# EAGLE design vewa-lfos (EAGLE 6.6.0)
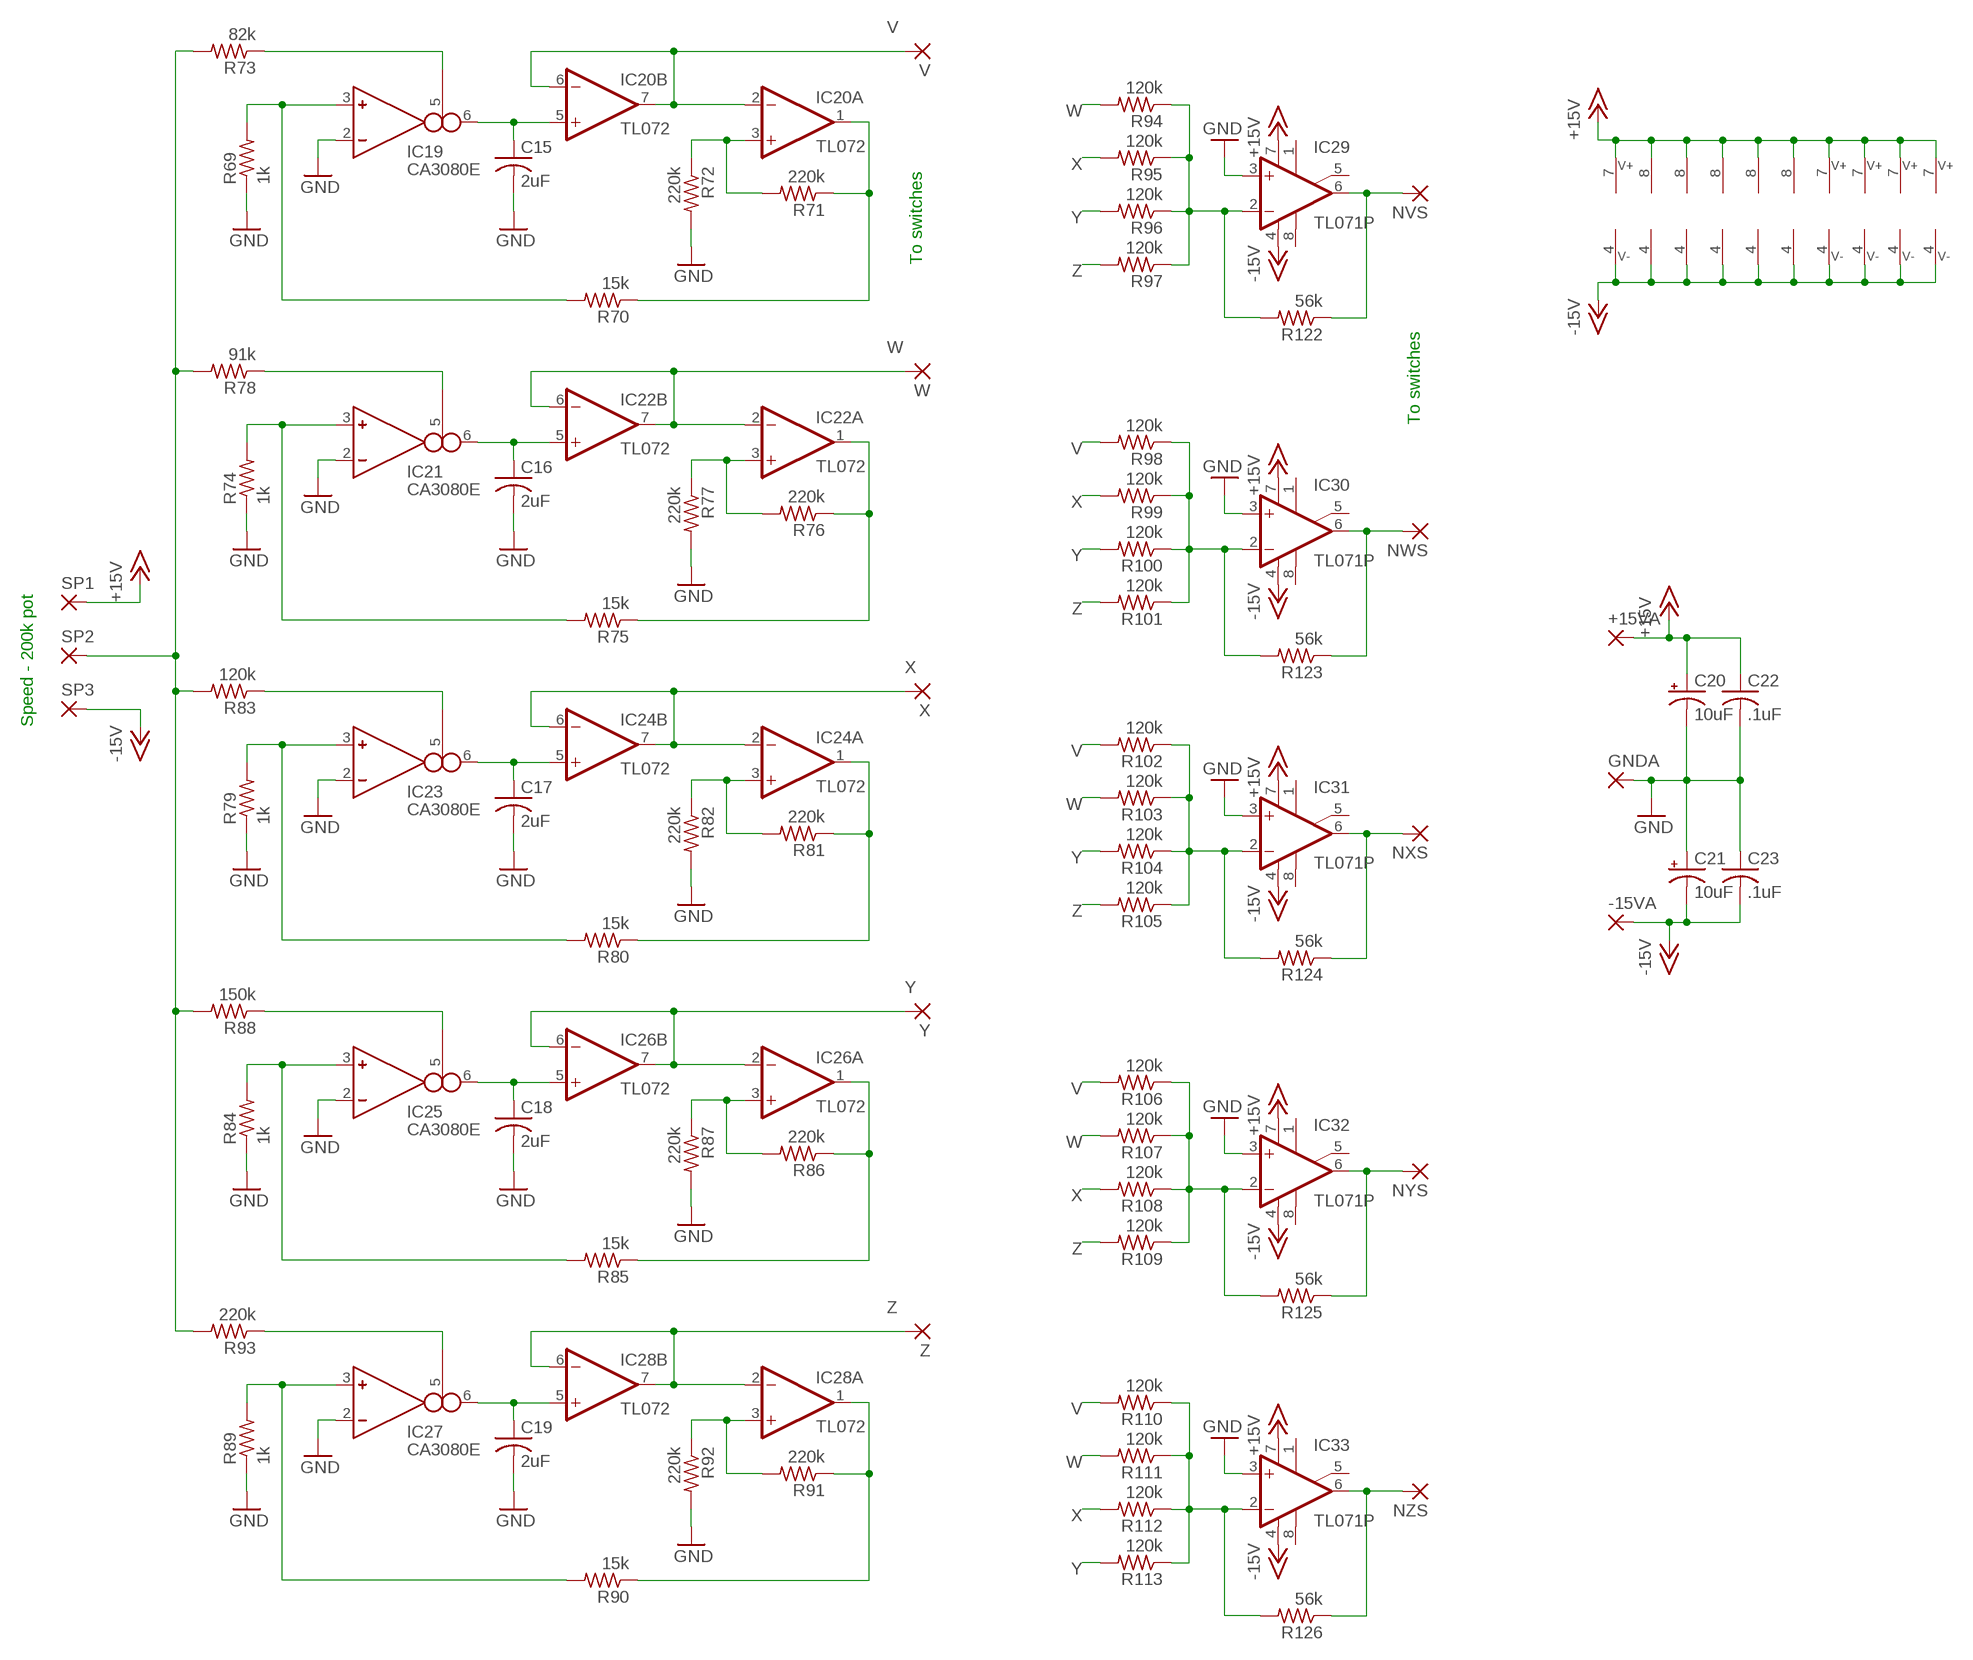
[diagram p0: schematic, sheet 1]

## Parts
+15VA  2,54/1,0  [2,54/1,0]
-15VA  2,54/1,0  [2,54/1,0]
C15  2uF  C-US050-025X075  [C050-025X075]
C16  2uF  C-US050-025X075  [C050-025X075]
C17  2uF  C-US050-025X075  [C050-025X075]
C18  2uF  C-US050-025X075  [C050-025X075]
C19  2uF  C-US050-025X075  [C050-025X075]
C20  10uF  CPOL-USE2.5-5  [E2,5-5]
C21  10uF  CPOL-USE2.5-5  [E2,5-5]
C22  .1uF  C-US050-025X075  [C050-025X075]
C23  .1uF  C-US050-025X075  [C050-025X075]
GNDA  2,54/1,0  [2,54/1,0]
IC19  CA3080E  [DIL08]
IC20  TL072  TL072-TOPP  [DIL08]
IC21  CA3080E  [DIL08]
IC22  TL072  TL072-TOPP  [DIL08]
IC23  CA3080E  [DIL08]
IC24  TL072  TL072-TOPP  [DIL08]
IC25  CA3080E  [DIL08]
IC26  TL072  TL072-TOPP  [DIL08]
IC27  CA3080E  [DIL08]
IC28  TL072  TL072-TOPP  [DIL08]
IC29  TL071P  [DIL08]
IC30  TL071P  [DIL08]
IC31  TL071P  [DIL08]
IC32  TL071P  [DIL08]
IC33  TL071P  [DIL08]
NVS  2,54/1,0  [2,54/1,0]
NWS  2,54/1,0  [2,54/1,0]
NXS  2,54/1,0  [2,54/1,0]
NYS  2,54/1,0  [2,54/1,0]
NZS  2,54/1,0  [2,54/1,0]
R69  1k  R-US_0207/10  [0207/10]
R70  15k  R-US_0207/10  [0207/10]
R71  220k  R-US_0207/10  [0207/10]
R72  220k  R-US_0207/10  [0207/10]
R73  82k  R-US_0207/10  [0207/10]
R74  1k  R-US_0207/10  [0207/10]
R75  15k  R-US_0207/10  [0207/10]
R76  220k  R-US_0207/10  [0207/10]
R77  220k  R-US_0207/10  [0207/10]
R78  91k  R-US_0207/10  [0207/10]
R79  1k  R-US_0207/10  [0207/10]
R80  15k  R-US_0207/10  [0207/10]
R81  220k  R-US_0207/10  [0207/10]
R82  220k  R-US_0207/10  [0207/10]
R83  120k  R-US_0207/10  [0207/10]
R84  1k  R-US_0207/10  [0207/10]
R85  15k  R-US_0207/10  [0207/10]
R86  220k  R-US_0207/10  [0207/10]
R87  220k  R-US_0207/10  [0207/10]
R88  150k  R-US_0207/10  [0207/10]
R89  1k  R-US_0207/10  [0207/10]
R90  15k  R-US_0207/10  [0207/10]
R91  220k  R-US_0207/10  [0207/10]
R92  220k  R-US_0207/10  [0207/10]
R93  220k  R-US_0207/10  [0207/10]
R94  120k  R-US_0207/10  [0207/10]
R95  120k  R-US_0207/10  [0207/10]
R96  120k  R-US_0207/10  [0207/10]
R97  120k  R-US_0207/10  [0207/10]
R98  120k  R-US_0207/10  [0207/10]
R99  120k  R-US_0207/10  [0207/10]
R100  120k  R-US_0207/10  [0207/10]
R101  120k  R-US_0207/10  [0207/10]
R102  120k  R-US_0207/10  [0207/10]
R103  120k  R-US_0207/10  [0207/10]
R104  120k  R-US_0207/10  [0207/10]
R105  120k  R-US_0207/10  [0207/10]
R106  120k  R-US_0207/10  [0207/10]
R107  120k  R-US_0207/10  [0207/10]
R108  120k  R-US_0207/10  [0207/10]
R109  120k  R-US_0207/10  [0207/10]
R110  120k  R-US_0207/10  [0207/10]
R111  120k  R-US_0207/10  [0207/10]
R112  120k  R-US_0207/10  [0207/10]
R113  120k  R-US_0207/10  [0207/10]
R122  56k  R-US_0207/10  [0207/10]
R123  56k  R-US_0207/10  [0207/10]
R124  56k  R-US_0207/10  [0207/10]
R125  56k  R-US_0207/10  [0207/10]
R126  56k  R-US_0207/10  [0207/10]
SP1  2,54/1,0  [2,54/1,0]
SP2  2,54/1,0  [2,54/1,0]
SP3  2,54/1,0  [2,54/1,0]
V  2,54/1,0  [2,54/1,0]
W  2,54/1,0  [2,54/1,0]
X  2,54/1,0  [2,54/1,0]
Y  2,54/1,0  [2,54/1,0]
Z  2,54/1,0  [2,54/1,0]

## Nets
+15V: +15VA.1(P) C20.+ C22.1 IC19.7 IC20.8(P:V+) IC21.7 IC22.8(P:V+) IC23.7 IC24.8(P:V+) IC25.7 IC26.8(P:V+) IC27.7 IC28.8(P:V+) IC29.7(V+) IC30.7(V+) IC31.7(V+) IC32.7(V+) IC33.7(V+) SP1.1(P)
-15V: -15VA.1(P) C21.- C23.2 IC19.4 IC20.4(P:V-) IC21.4 IC22.4(P:V-) IC23.4 IC24.4(P:V-) IC25.4 IC26.4(P:V-) IC27.4 IC28.4(P:V-) IC29.4(V-) IC30.4(V-) IC31.4(V-) IC32.4(V-) IC33.4(V-) SP3.1(P)
GND: C15.2 C16.2 C17.2 C18.2 C19.2 C20.- C21.+ C22.2 C23.1 GNDA.1(P) IC19.2(IN_N) IC21.2(IN_N) IC23.2(IN_N) IC25.2(IN_N) IC27.2(IN_N) IC29.3(+IN) IC30.3(+IN) IC31.3(+IN) IC32.3(+IN) IC33.3(+IN) R69.1 R72.2 R74.1 R77.2 R79.1 R82.2 R84.1 R87.2 R89.1 R92.2
N$53: C15.1 IC19.6(OUT) IC20.5(B:+IN)
N$54: IC20.3(A:+IN) R71.2 R72.1
N$55: IC20.1(A:OUT) R70.1 R71.1
N$56: IC19.3(IN_P) R69.2 R70.2
N$57: IC19.5(I_BIAS) R73.1
N$60: C16.1 IC21.6(OUT) IC22.5(B:+IN)
N$61: IC22.3(A:+IN) R76.2 R77.1
N$62: IC22.1(A:OUT) R75.1 R76.1
N$63: IC21.3(IN_P) R74.2 R75.2
N$64: IC21.5(I_BIAS) R78.1
N$66: IC29.2(-IN) R94.1 R95.1 R96.1 R97.1 R122.2
N$67: C17.1 IC23.6(OUT) IC24.5(B:+IN)
N$68: IC24.3(A:+IN) R81.2 R82.1
N$69: IC24.1(A:OUT) R80.1 R81.1
N$70: IC23.3(IN_P) R79.2 R80.2
N$71: IC23.5(I_BIAS) R83.1
N$72: IC30.2(-IN) R98.1 R99.1 R100.1 R101.1 R123.2
N$73: IC31.2(-IN) R102.1 R103.1 R104.1 R105.1 R124.2
N$74: C18.1 IC25.6(OUT) IC26.5(B:+IN)
N$75: IC26.3(A:+IN) R86.2 R87.1
N$76: IC26.1(A:OUT) R85.1 R86.1
N$77: IC25.3(IN_P) R84.2 R85.2
N$78: IC25.5(I_BIAS) R88.1
N$79: IC32.2(-IN) R106.1 R107.1 R108.1 R109.1 R125.2
N$80: IC33.2(-IN) R110.1 R111.1 R112.1 R113.1 R126.2
N$81: C19.1 IC27.6(OUT) IC28.5(B:+IN)
N$82: IC28.3(A:+IN) R91.2 R92.1
N$83: IC28.1(A:OUT) R90.1 R91.1
N$84: IC27.3(IN_P) R89.2 R90.2
N$85: IC27.5(I_BIAS) R93.1
N$86: R73.2 R78.2 R83.2 R88.2 R93.2 SP2.1(P)
NVS: IC29.6(OUT) NVS.1(P) R122.1
NWS: IC30.6(OUT) NWS.1(P) R123.1
NXS: IC31.6(OUT) NXS.1(P) R124.1
NYS: IC32.6(OUT) NYS.1(P) R125.1
NZS: IC33.6(OUT) NZS.1(P) R126.1
V: IC20.2(A:-IN) IC20.6(B:-IN) IC20.7(B:OUT) R98.2 R102.2 R106.2 R110.2 V.1(P)
W: IC22.2(A:-IN) IC22.6(B:-IN) IC22.7(B:OUT) R94.2 R103.2 R107.2 R111.2 W.1(P)
X: IC24.2(A:-IN) IC24.6(B:-IN) IC24.7(B:OUT) R95.2 R99.2 R108.2 R112.2 X.1(P)
Y: IC26.2(A:-IN) IC26.6(B:-IN) IC26.7(B:OUT) R96.2 R100.2 R104.2 R113.2 Y.1(P)
Z: IC28.2(A:-IN) IC28.6(B:-IN) IC28.7(B:OUT) R97.2 R101.2 R105.2 R109.2 Z.1(P)
Unconnected: IC29.1(ON1) IC29.5(ON2) IC29.8(OPT) IC30.1(ON1) IC30.5(ON2) IC30.8(OPT) IC31.1(ON1) IC31.5(ON2) IC31.8(OPT) IC32.1(ON1) IC32.5(ON2) IC32.8(OPT) IC33.1(ON1) IC33.5(ON2) IC33.8(OPT)

## Notes on the sheet
- To switches
- To switches
- Speed - 200k pot

## Library data of the parts
+15VA -15VA GNDA NVS NWS NXS NYS NZS SP1-SP3 V W X Y Z = wirepad:2,54/1,0: THROUGH-HOLE PAD
C15-C19 C22 C23 = rcl:C-US: CAPACITOR, American symbol
C20 C21 = rcl:CPOL-US: POLARIZED CAPACITOR, American symbol
IC19 IC21 IC23 IC25 IC27 = mmoretti:CA3080: OTA
IC20 IC22 IC24 IC26 IC28 = mmoretti:TL072-TOP: OP AMP
IC29-IC33 = mmoretti:TL071: OP AMP
R69-R113 R122-R126 = rcl:R-US_: RESISTOR, American symbol

## Board
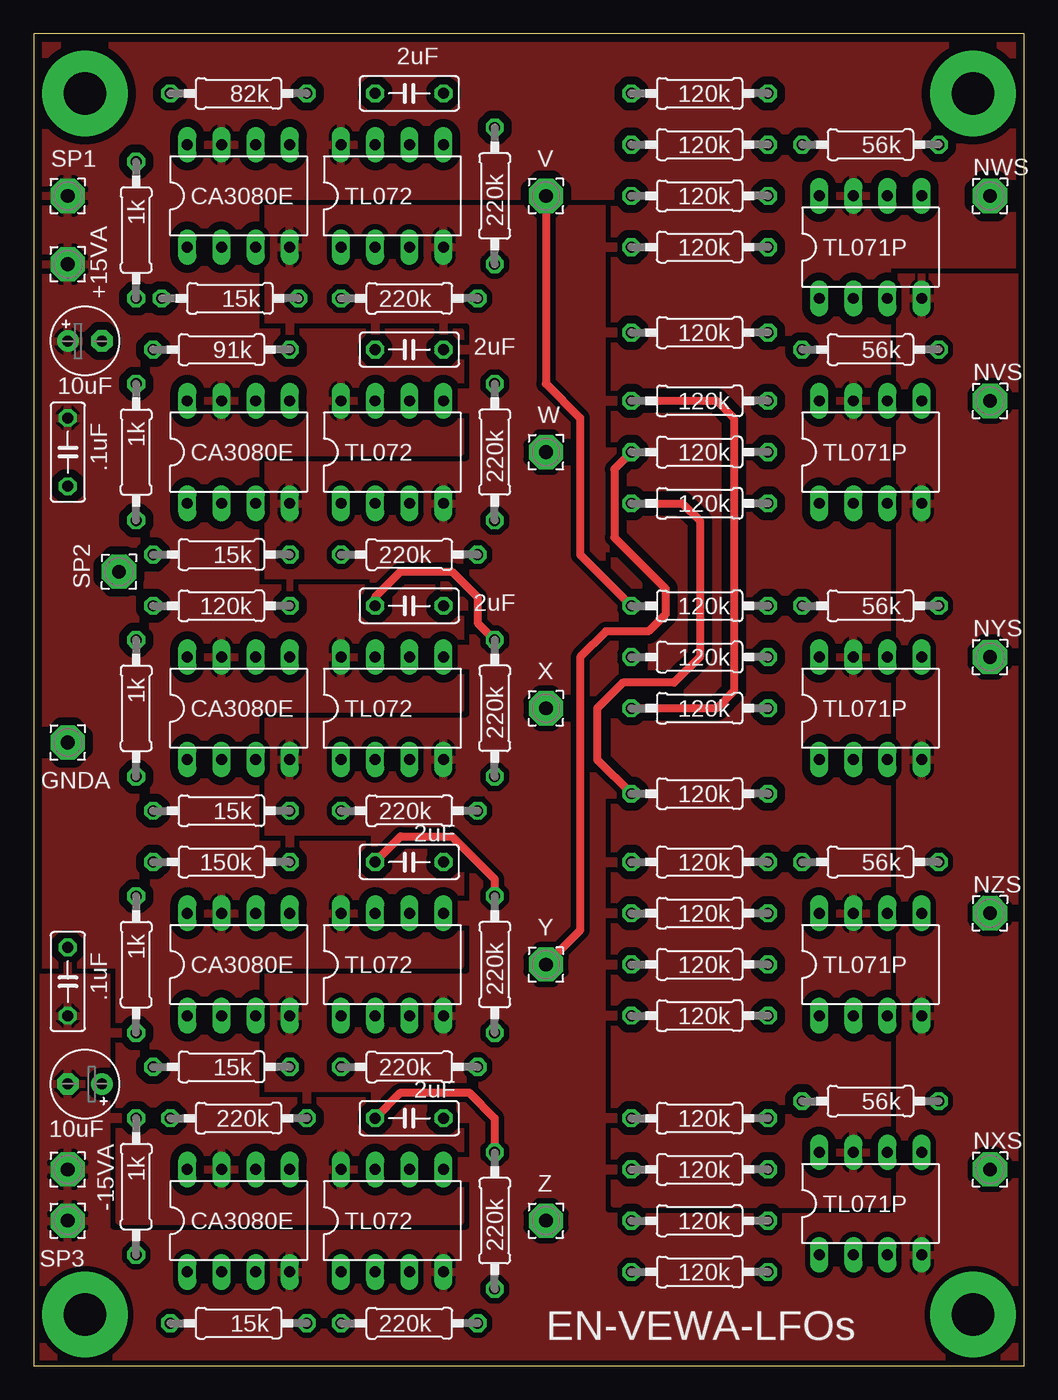
[diagram p1: board, top side]
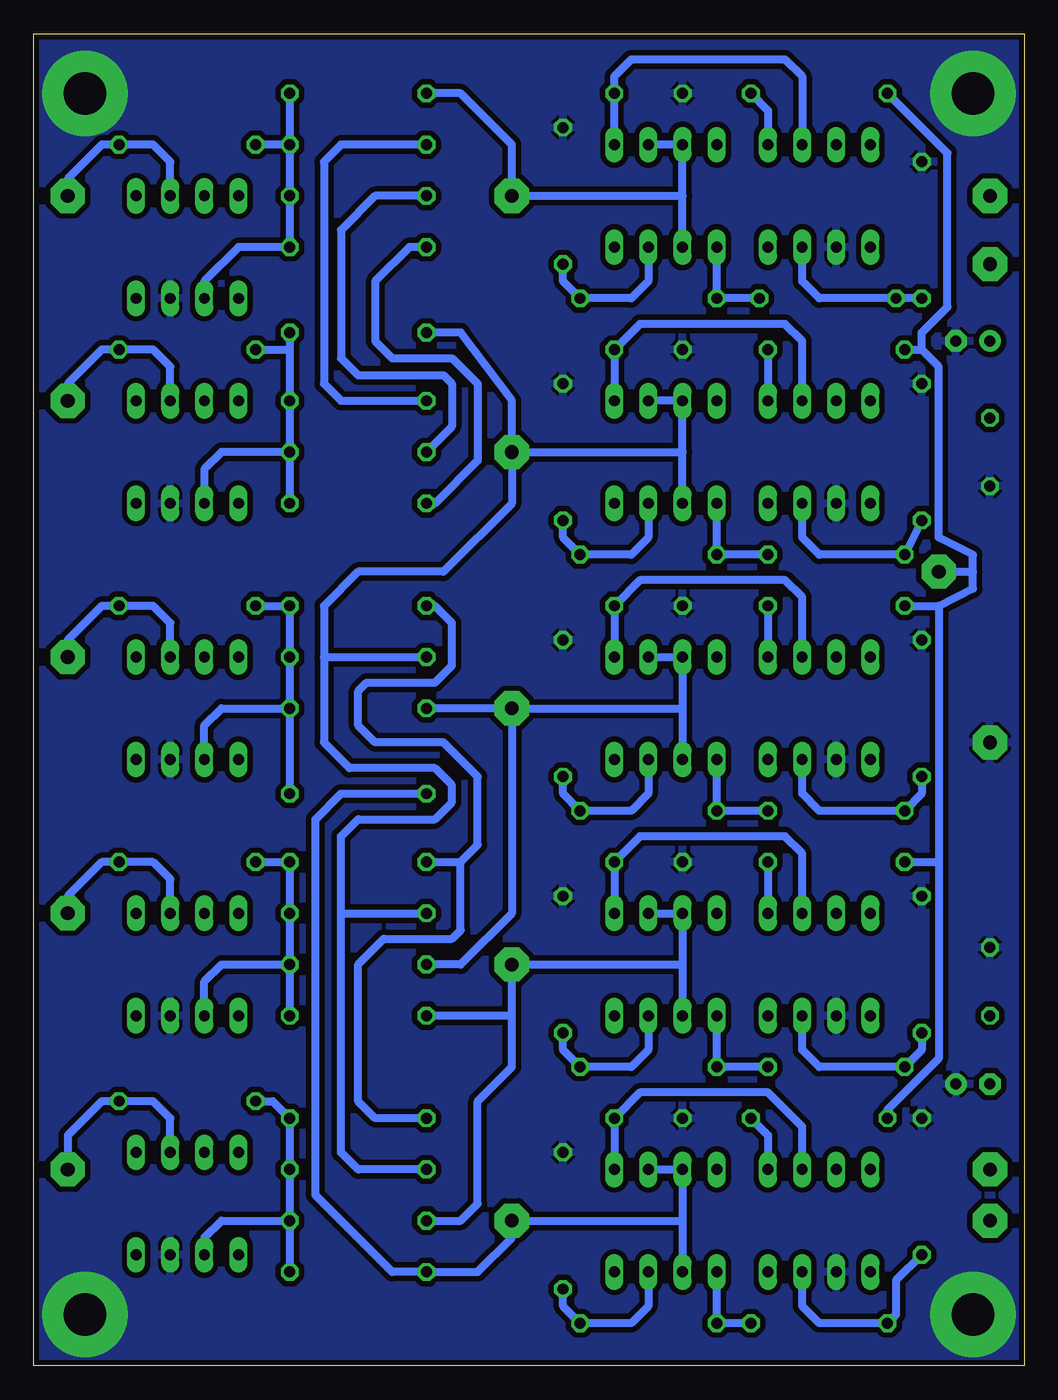
[diagram p2: board, bottom side, seen from below]

Size 73.66 x 99.06 mm. Coordinates in mm from the lower left corner, seen from the top.
Outline: 0,0 73.66,0 73.66,99.06 0,99.06 0,0
Copper layers (1*16): Top 0.035mm / dielectric 1.5mm / Bottom 0.035mm
Design rules "SeeedStudio_2layer_DRU_no_angle_20140221": minimum track width 6mil, minimum drill 12mil, track to track 6mil, track to pad 6mil, pad to pad 6mil, via to via 6mil, smd to smd 0mil, copper to edge 10mil, drill to drill 10mil, minimum pad ring 10mil, minimum via ring 6mil, stop-mask expansion 2mil, vias tented up to drill 100mil, thermal gap 10mil

### Footprints (pad centres in the part's own frame; a part is rotated, then mirrored left to right if it is on the bottom)
2,54/1,0 = drill 1.016 pad 2.54 octagon: 1 0,0
C050-025X075 = drill 0.813 octagon: 1 -2.54,0; 2 2.54,0
E2,5-5 = drill 0.813 pad 1.6: + -1.27,0 | drill 0.813 pad 1.6 octagon: - 1.27,0
DIL08 = drill 0.813 long: 1 -3.81,-3.81; 2 -1.27,-3.81; 3 1.27,-3.81; 4 3.81,-3.81; 5 3.81,3.81; 6 1.27,3.81; 7 -1.27,3.81; 8 -3.81,3.81
0207/10 = drill 0.813 octagon: 1 -5.08,0; 2 5.08,0

### Placement (x,y rotation side)
+15VA  2.54,81.92 0 top
-15VA  2.54,14.61 0 top
C15  27.94,94.61 180 top
C16  27.94,75.56 180 top
C17  27.94,56.52 180 top
C18  27.94,37.47 180 top
C19  27.94,18.41 180 top
C20  3.81,76.2 0 top
C21  3.81,20.95 180 top
C22  2.54,67.94 270 top
C23  2.54,28.57 270 top
GNDA  2.54,46.35 0 top
IC19  15.24,87 0 top
IC20  26.67,87 0 top
IC21  15.24,67.94 0 top
IC22  26.67,67.94 0 top
IC23  15.24,48.9 0 top
IC24  26.67,48.9 0 top
IC25  15.24,29.84 0 top
IC26  26.67,29.84 0 top
IC27  15.24,10.79 0 top
IC28  26.67,10.79 0 top
IC29  62.23,67.94 0 top
IC30  62.23,83.19 0 top
IC31  62.23,12.06 0 top
IC32  62.23,48.9 0 top
IC33  62.23,29.84 0 top
NVS  71.12,71.75 0 top
NWS  71.12,87 0 top
NXS  71.12,14.61 0 top
NYS  71.12,52.7 0 top
NZS  71.12,33.66 0 top
R69  7.62,84.45 270 top
R70  14.61,79.38 180 top
R71  27.94,79.38 0 top
R72  34.29,87 90 top
R73  15.24,94.61 180 top
R74  7.62,67.94 270 top
R75  13.97,60.33 180 top
R76  27.94,60.33 0 top
R77  34.29,67.94 90 top
R78  13.97,75.56 180 top
R79  7.62,48.9 270 top
R80  13.97,41.27 180 top
R81  27.94,41.27 0 top
R82  34.29,48.9 90 top
R83  13.97,56.52 180 top
R84  7.62,29.84 270 top
R85  13.97,22.23 180 top
R86  27.94,22.23 0 top
R87  34.29,29.84 90 top
R88  13.97,37.47 180 top
R89  7.62,13.34 270 top
R90  15.24,3.17 180 top
R91  27.94,3.17 0 top
R92  34.29,10.79 90 top
R93  15.24,18.41 180 top
R94  49.53,76.83 180 top
R95  49.53,71.75 180 top
R96  49.53,67.94 180 top
R97  49.53,64.14 180 top
R98  49.53,94.61 180 top
R99  49.53,90.81 180 top
R100  49.53,87 180 top
R101  49.53,83.19 180 top
R102  49.53,18.41 180 top
R103  49.53,14.61 180 top
R104  49.53,10.79 180 top
R105  49.53,6.99 180 top
R106  49.53,56.52 180 top
R107  49.53,52.7 180 top
R108  49.53,48.9 180 top
R109  49.53,42.55 180 top
R110  49.53,37.47 180 top
R111  49.53,33.66 180 top
R112  49.53,29.84 180 top
R113  49.53,26.04 180 top
R122  62.23,75.56 180 top
R123  62.23,90.81 180 top
R124  62.23,19.68 180 top
R125  62.23,56.52 180 top
R126  62.23,37.47 180 top
SP1  2.54,87 0 top
SP2  6.35,59.05 0 top
SP3  2.54,10.79 0 top
V  38.1,87 0 top
W  38.1,67.94 0 top
X  38.1,48.9 0 top
Y  38.1,29.84 0 top
Z  38.1,10.79 0 top

### Tracks (layer width: path | path; a pad name or v marks a point on that pad's centre or on a via)
+15V
  pour Top (isolate 0.61): 0,29.84 6.35,29.84 6.35,10.79 31.75,10.79 31.75,19.68 16.51,19.68 16.51,29.84 31.75,29.84 31.75,38.73 16.51,38.73 16.51,48.9 31.75,48.9 31.75,57.78 16.51,57.78 16.51,67.94 31.75,67.94 31.75,76.83 16.51,76.83 16.51,87 43.18,87 43.18,12.06 63.5,12.06 63.5,81.92 73.66,81.92 73.66,99.06 0,99.06
-15V
  pour Top (isolate 0.406, rank 2): 0,29.84 6.35,29.84 6.35,10.79 31.75,10.79 31.75,19.68 16.51,19.68 16.51,29.84 31.75,29.84 31.75,38.73 16.51,38.73 16.51,48.9 31.75,48.9 31.75,57.78 16.51,57.78 16.51,67.94 31.75,67.94 31.75,76.83 16.51,76.83 16.51,87 43.18,87 43.18,12.06 63.5,12.06 63.5,81.92 73.66,81.92 73.66,0 0,0
GND  (via drill 3.17 pad 6.35)
  Top 0.61: C18.2 27.3,39.37 31.11,39.37 34.29,36.2 R87.2 | C17.2 25.4,57.15 27.3,59.05 31.11,59.05 33.02,57.15 33.02,55.24 R82.2 | C19.2 27.3,20.32 32.38,20.32 34.29,18.41 R92.2
  other vias: 3.81,94.61 69.85,94.61 69.85,3.81 3.81,3.81
  pour Bottom (isolate 0.406): 0,99.06 73.66,99.06 73.66,0 0,0
N$53
  Bottom 0.61: C15.1 IC20.5 30.48,95.89 29.21,97.16 17.78,97.16 16.51,95.89 IC19.6
N$54
  Bottom 0.61: IC20.3 27.94,80.64 29.21,79.38 R71.2 34.29,80.64 R72.1
N$55
  Bottom 0.61: R70.1 R71.1 IC20.1
N$56
  Bottom 0.61: R69.2 R70.2 15.24,79.38 16.51,80.64 IC19.3
N$57
  Bottom 0.61: R73.1 19.05,93.34 IC19.5
N$60
  Bottom 0.61: IC22.5 C16.1 28.57,77.47 17.78,77.47 16.51,76.2 IC21.6
N$61
  Bottom 0.61: IC22.3 27.94,61.59 29.21,60.33 R76.2 34.29,61.59 R77.1
N$62
  Bottom 0.61: R75.1 R76.1 IC22.1
N$63
  Bottom 0.61: IC21.3 16.51,61.59 15.24,60.33 R75.2 R74.2
N$64
  Bottom 0.61: R78.1 IC21.5
N$66
  Bottom 0.61: R94.1 54.61,75.56 | 54.61,75.56 R95.1 R96.1 | R96.1 R97.1 | R122.2 54.61,75.56 | R96.1 59.69,67.94 60.96,66.67 IC29.2
N$67
  Bottom 0.61: IC23.6 16.51,57.15 17.78,58.42 28.57,58.42 C17.1 IC24.5
N$68
  Bottom 0.61: IC24.3 27.94,42.55 29.21,41.27 R81.2 34.29,42.55 R82.1
N$69
  Bottom 0.61: R80.1 R81.1 IC24.1
N$70
  Bottom 0.61: R79.2 7.62,42.55 R80.2 15.24,41.27 16.51,42.55 IC23.3
N$71
  Bottom 0.61: R83.1 IC23.5
N$72
  Bottom 0.61: R98.1 R99.1 | R99.1 R100.1 R101.1 58.42,83.19 60.96,80.64 IC30.2 | R99.1 R123.2
N$73
  Bottom 0.61: R124.2 55.88,19.68 R102.1 R103.1 R104.1 | R104.1 R105.1 | IC31.2 60.96,9.53 59.69,10.79 R104.1
N$74
  Bottom 0.61: IC25.6 16.51,38.1 17.78,39.37 28.57,39.37 C18.1 IC26.5
N$75
  Bottom 0.61: IC26.3 27.94,23.5 29.21,22.23 R86.2 34.29,23.5 R87.1
N$76
  Bottom 0.61: R85.1 R86.1 IC26.1
N$77
  Bottom 0.61: R84.2 7.62,23.5 R85.2 15.24,22.23 16.51,23.5 IC25.3
N$78
  Bottom 0.61: R88.1 IC25.5
N$79
  Bottom 0.61: R125.2 R106.1 R107.1 R108.1 | R108.1 R109.1 | IC32.2 60.96,47.62 59.69,48.9 R108.1
N$80
  Bottom 0.61: R126.2 R110.1 R111.1 R112.1 | R112.1 R113.1 | IC33.2 60.96,28.57 59.69,29.84 R112.1
N$81
  Bottom 0.61: IC27.6 16.51,17.78 19.05,20.32 28.57,20.32 C19.1 IC28.5
N$82
  Bottom 0.61: IC28.3 27.94,4.45 29.21,3.17 R91.2 34.29,4.45 R92.1
N$83
  Bottom 0.61: R90.1 R91.1 IC28.1
N$84
  Bottom 0.61: R89.2 9.53,6.35 9.53,3.81 R90.2 15.24,3.17 16.51,4.45 IC27.3
N$85
  Bottom 0.61: R93.1 19.05,17.14 IC27.5
N$86
  Bottom 0.61: R93.2 10.16,19.05 6.35,22.86 6.35,37.47 | 6.35,56.52 6.35,37.47 | R88.2 6.35,37.47 | 6.35,56.52 3.81,57.78 3.81,59.05 | 3.81,59.05 3.81,60.33 6.35,61.59 6.35,74.3 7.62,75.56 | 7.62,75.56 7.62,76.83 5.71,78.74 5.71,90.17 R73.2 | R78.2 7.62,75.56 | SP2.1 3.81,59.05 | R83.2 6.35,56.52
NVS
  Bottom 0.61: IC29.6 63.5,74.3 64.77,75.56 R122.1 68.58,75.56 71.12,73.03 NVS.1
NWS
  Bottom 0.61: IC30.6 63.5,89.53 64.77,90.81 R123.1 68.58,90.81 71.12,88.27 NWS.1
NXS
  Bottom 0.61: IC31.6 63.5,18.41 64.77,19.68 R124.1 68.58,19.68 71.12,17.14 NXS.1
NYS
  Bottom 0.61: IC32.6 63.5,55.24 64.77,56.52 R125.1 68.58,56.52 71.12,53.98 NYS.1
NZS
  Bottom 0.61: IC33.6 63.5,36.2 64.77,37.47 R126.1 68.58,37.47 71.12,34.92 NZS.1
V
  Top 0.61: V.1 38.1,73.03 40.64,70.48 40.64,60.33 R106.2
  Bottom 0.61: IC20.2 25.4,87 | 25.4,87 IC20.7 IC20.6 | 25.4,87 V.1 38.1,90.81 41.91,94.61 R98.2 | R102.2 48.26,18.41 49.53,19.68 49.53,29.84 47.62,31.75 42.55,31.75 41.91,32.38 41.91,37.47 | R110.2 41.91,37.47 | 41.91,37.47 40.64,38.73 40.64,43.81 43.18,46.35 48.26,46.35 49.53,47.62 49.53,50.16 48.9,50.8 43.81,50.8 42.55,52.07 42.55,55.24 43.81,56.52 R106.2
W
  Bottom 0.61: IC22.2 25.4,67.94 | 25.4,67.94 IC22.7 IC22.6 | W.1 25.4,67.94 | W.1 38.1,71.75 41.91,76.83 R94.2 | R103.2 49.53,14.61 50.8,15.88 50.8,33.66 | 50.8,33.66 R111.2 | 50.8,33.66 50.8,39.37 49.53,40.64 43.81,40.64 42.55,41.91 42.55,43.18 43.81,44.45 50.16,44.45 52.07,46.35 52.07,52.7 | 52.07,52.7 R107.2 | W.1 38.1,64.14 43.18,59.05 49.53,59.05 52.07,56.52 52.07,52.7
X
  Top 0.61: R95.2 50.8,71.75 52.07,70.48 52.07,50.16 50.8,48.9 R108.2
  Bottom 0.61: IC24.6 IC24.7 25.4,48.9 | 25.4,48.9 IC24.2 | X.1 25.4,48.9 | X.1 R108.2 | X.1 38.1,33.66 41.91,29.84 R112.2 | R99.2 50.8,90.81 52.07,89.53 52.07,73.03 50.8,71.75 R95.2
Y
  Top 0.61: R96.2 43.18,66.67 43.18,61.59 46.99,57.78 46.99,55.88 45.72,54.61 42.55,54.61 40.64,52.7 40.64,32.38 Y.1
  Bottom 0.61: IC26.6 IC26.7 25.4,29.84 | 25.4,29.84 IC26.2 | Y.1 25.4,29.84 | Y.1 38.1,28.57 | 38.1,26.04 R113.2 | R104.2 41.91,10.79 40.64,12.06 40.64,19.68 38.1,22.23 38.1,26.04 | 38.1,26.04 Y.1 | R100.2 48.26,87 50.8,84.45 50.8,74.93 49.53,73.66 43.18,73.66 42.55,73.03 42.55,69.85 R96.2
Z
  Top 0.61: R97.2 48.26,64.14 49.53,62.87 49.53,52.7 47.62,50.8 43.81,50.8 41.91,48.9 41.91,45.09 R109.2
  Bottom 0.61: IC28.6 IC28.7 25.4,10.79 | 25.4,10.79 IC28.2 | 25.4,10.79 Z.1 38.1,9.53 40.64,6.99 R105.2 46.99,6.99 52.7,12.7 52.7,40.64 50.8,42.55 R109.2 | R101.2 45.72,83.19 48.26,80.64 48.26,76.2 46.99,74.93 42.55,74.93 40.64,73.03 40.64,67.31 43.81,64.14 R97.2

### Text on the board
tNames: EN-VEWA-LFOs